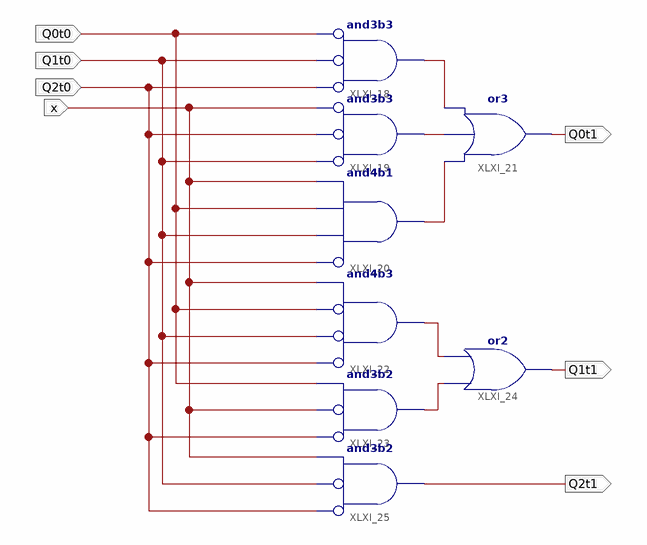
[diagram p0: schematic sheet 1]
// Xilinx ISE schematic logika.sch (spartan3e) as structural Verilog: 8 symbols, 7 ports
module logika (
  input  Q0t0,
  input  Q1t0,
  input  Q2t0,
  input  x,
  output Q1t1,
  output Q0t1,
  output Q2t1
);

  wire XLXN_93, XLXN_94, XLXN_95, XLXN_114, XLXN_116;

  and XLXI_18 (XLXN_93, ~Q2t0, ~Q1t0, ~Q0t0);  // and3b3
  and XLXI_19 (XLXN_94, ~Q1t0, ~Q2t0, ~x);  // and3b3
  or XLXI_24 (Q1t1, XLXN_116, XLXN_114);
  or XLXI_21 (Q0t1, XLXN_95, XLXN_94, XLXN_93);
  and XLXI_22 (XLXN_114, ~Q2t0, ~Q1t0, ~Q0t0, x);  // and4b3
  and XLXI_20 (XLXN_95, ~Q2t0, Q1t0, Q0t0, x);  // and4b1
  and XLXI_23 (XLXN_116, ~Q2t0, ~x, Q0t0);  // and3b2
  and XLXI_25 (Q2t1, ~Q2t0, ~Q1t0, x);  // and3b2
endmodule
